# EAGLE design SIM900_schematic (EAGLE 7.6.0)

## Sheet 1 of 2
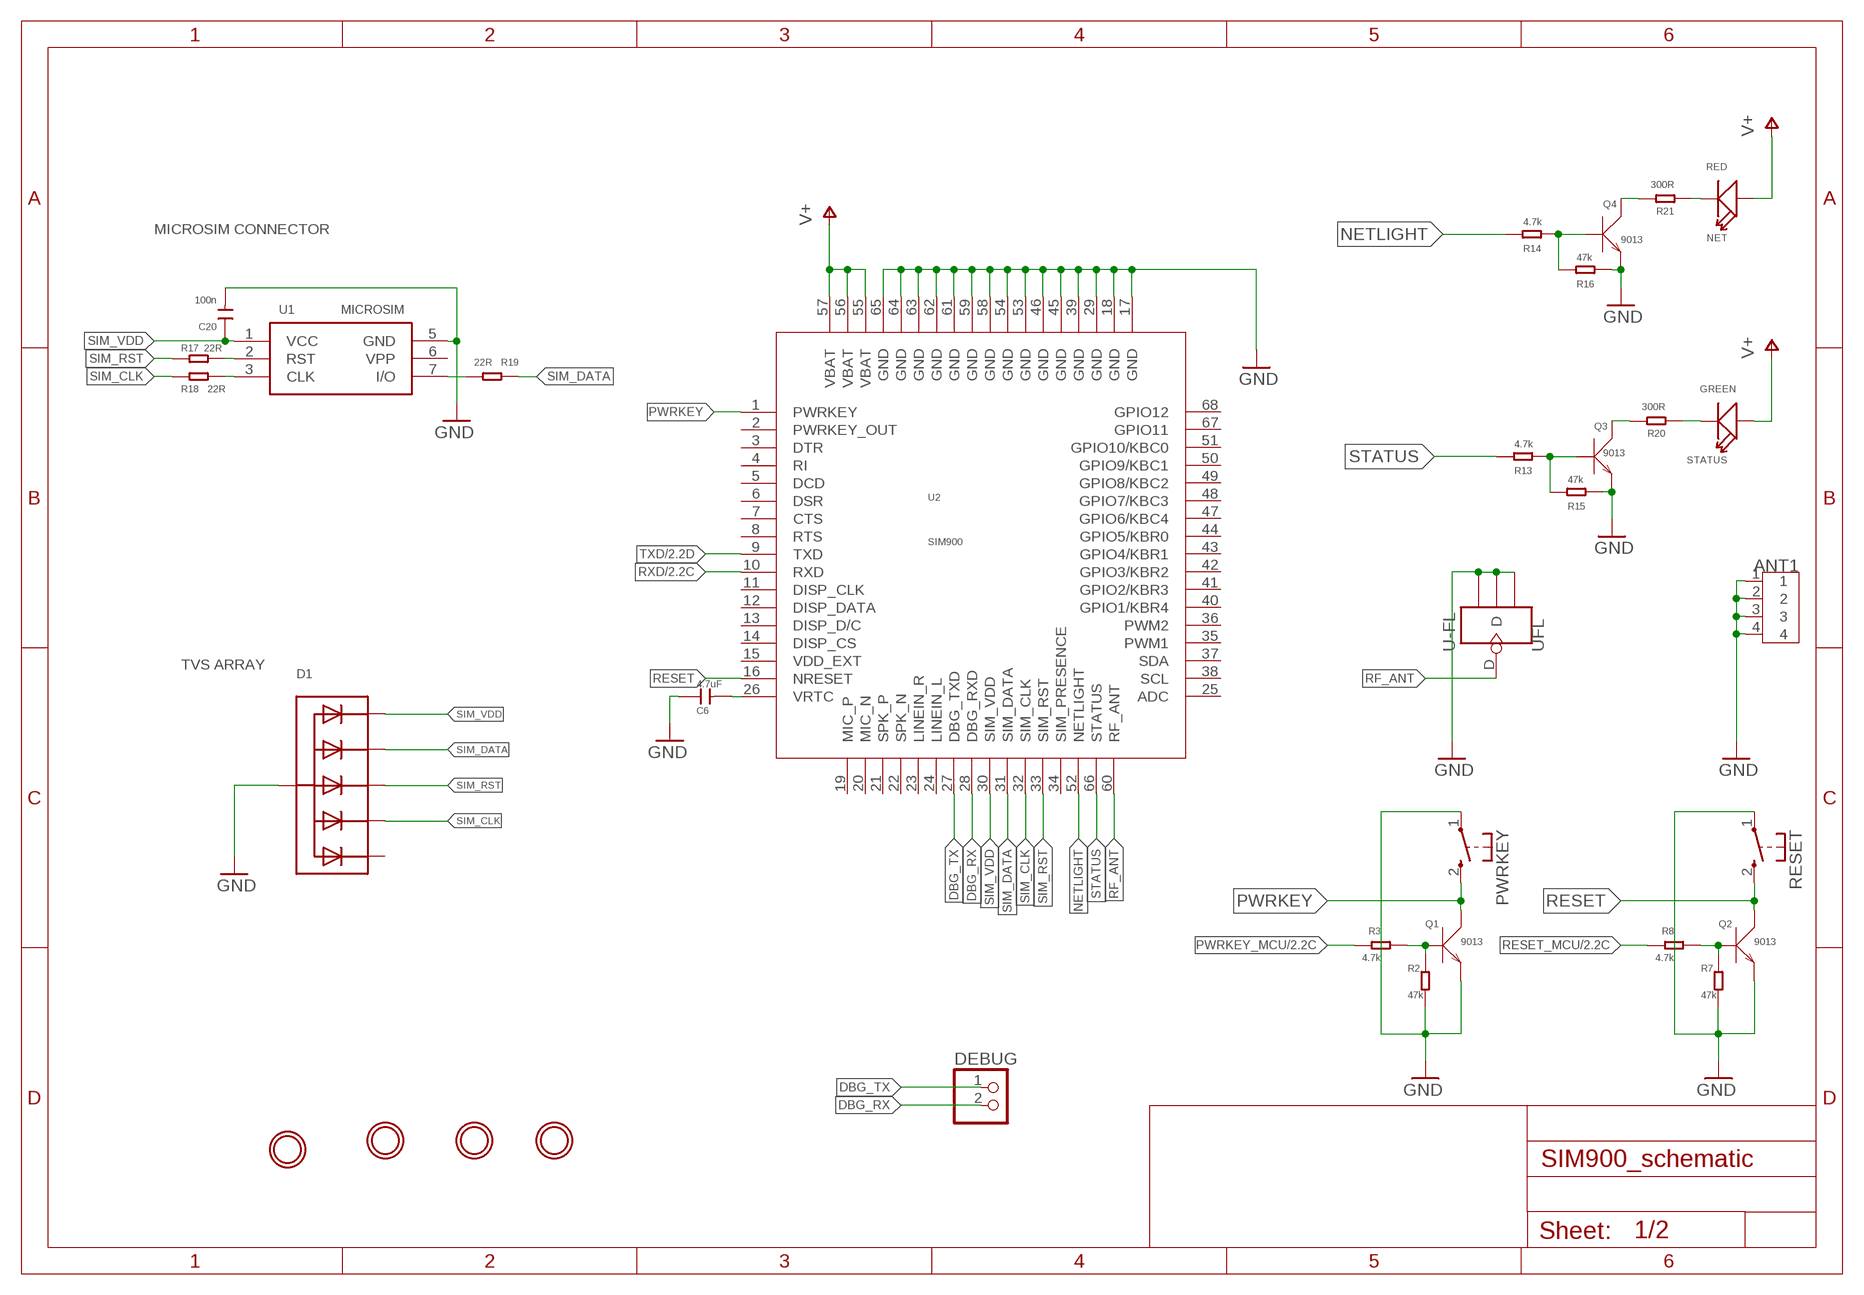
[diagram p0: schematic, sheet 1]

### Parts
ANT1  ANTENNA-SMA-IPX  [SMA-TO-IPX]
C6  4.7uF  C-0805  [0805]
C20  100n  C-0805  [0805]
D1  TVSARRAY_5LANE  [SOT363]
DEBUG  PINHD-1X2  [1X02]
NET  RED  LED'0805'  [LED-0805]
PWRKEY  KSS-2EG4430  [KSS-2EG4430]
Q1  9013  TRANSISTOR-NPN-SOT23  [SOT23]
Q2  9013  TRANSISTOR-NPN-SOT23  [SOT23]
Q3  9013  TRANSISTOR-NPN-SOT23  [SOT23]
Q4  9013  TRANSISTOR-NPN-SOT23  [SOT23]
R2  47k  R-0805  [0805]
R3  4.7k  R-0805  [0805]
R7  47k  R-0805  [0805]
R8  4.7k  R-0805  [0805]
R13  4.7k  R-0805  [0805]
R14  4.7k  R-0805  [0805]
R15  47k  R-0805  [0805]
R16  47k  R-0805  [0805]
R17  22R  R-0805  [0805]
R18  22R  R-0805  [0805]
R19  22R  R-0805  [0805]
R20  300R  R-0805  [0805]
R21  300R  R-0805  [0805]
RESET  KSS-2EG4430  [KSS-2EG4430]
STATUS  GREEN  LED'0805'  [LED-0805]
U1  MICROSIM  [MICROSIM]
U2  SIM900  [SIM900]
U$1  MOUNTINGHOLE3.0THIN  [MOUNTINGHOLE_3.0_PLATEDTHIN]
U$2  MOUNTINGHOLE3.0THIN  [MOUNTINGHOLE_3.0_PLATEDTHIN]
U$3  MOUNTINGHOLE3.0THIN  [MOUNTINGHOLE_3.0_PLATEDTHIN]
U$4  MOUNTINGHOLE3.0THIN  [MOUNTINGHOLE_3.0_PLATEDTHIN]
UFL  U-FL  ANTENNA-U-FL  [4P-U-FL]

### Nets
DBG_RX: DEBUG.2 U2.28(DBG_RXD)
DBG_TX: DEBUG.1 U2.27(DBG_TXD)
GND: ANT1.1 ANT1.2 ANT1.3 ANT1.4 C6.1 C20.2 D1.2(A) PWRKEY.1(P) Q1.2(E) Q2.2(E) Q3.2(E) Q4.2(E) R2.2 R7.2 R15.2 R16.2 RESET.1(P) U1.5(GND) U2.17(GND) U2.18(GND) U2.29(GND) U2.39(GND) U2.45(GND) U2.46(GND) U2.53(GND) U2.54(GND) U2.58(GND) U2.59(GND) U2.61(GND) U2.62(GND) U2.63(GND) U2.64(GND) U2.65(GND) UFL.GND1 UFL.GND2 UFL.GND3 ; also sheet 2
N$1: Q2.1(B) R7.1 R8.2
N$3: Q3.3(C) R20.2
N$4: R19.2 U1.7(I/O)
N$5: R18.1 U1.3(CLK)
N$6: R17.1 U1.2(RST)
N$7: R20.1 STATUS.-
N$8: Q3.1(B) R13.2 R15.1
N$16: Q4.3(C) R21.2
N$17: NET.- R21.1
N$18: Q4.1(B) R14.2 R16.1
N$36: Q1.1(B) R2.1 R3.2
NETLIGHT: R14.1 U2.52(NETLIGHT)
PWRKEY: PWRKEY.2(S) Q1.3(C) U2.1(PWRKEY)
PWRKEY_MCU: R3.1 ; also sheet 2
RESET: Q2.3(C) RESET.2(S) U2.16(NRESET)
RESET_MCU: R8.1 ; also sheet 2
RF_ANT [ref]: U2.60(RF_ANT) UFL.D
RXD: U2.10(RXD) ; also sheet 2
SIM_CLK: D1.5(C4) R18.2 U2.32(SIM_CLK)
SIM_DATA: D1.3(C2) R19.1 U2.31(SIM_DATA)
SIM_RST: D1.4(C3) R17.2 U2.33(SIM_RST)
SIM_VDD: C20.1 D1.1(C1) U1.1(VCC) U2.30(SIM_VDD)
STATUS: R13.1 U2.66(STATUS)
TXD: U2.9(TXD) ; also sheet 2
V+: NET.+ STATUS.+ U2.55(VBAT) U2.56(VBAT) U2.57(VBAT) ; also sheet 2
VRTC: C6.2 U2.26(VRTC)
Unconnected: D1.6(C5) U1.6(VPP) U2.2(PWRKEY_OUT) U2.3(DTR) U2.4(RI) U2.5(DCD) U2.6(DSR) U2.7(CTS) U2.8(RTS) U2.11(DISP_CLK) U2.12(DISP_DATA) U2.13(DISP_D/C) U2.14(DISP_CS) U2.15(VDD_EXT) U2.19(MIC_P) U2.20(MIC_N) U2.21(SPK_P) U2.22(SPK_N) U2.23(LINEIN_R) U2.24(LINEIN_L) U2.25(ADC) U2.34(SIM_PRESENCE) U2.35(PWM1) U2.36(PWM2) U2.37(SDA) U2.38(SCL) U2.40(GPIO1/KBR4) U2.41(GPIO2/KBR3) U2.42(GPIO3/KBR2) U2.43(GPIO4/KBR1) U2.44(GPIO5/KBR0) U2.47(GPIO6/KBC4) U2.48(GPIO7/KBC3) U2.49(GPIO8/KBC2) U2.50(GPIO9/KBC1) U2.51(GPIO10/KBC0) U2.67(GPIO11) U2.68(GPIO12)

### Notes on the sheet
- MICROSIM CONNECTOR
- TVS ARRAY

## Sheet 2 of 2
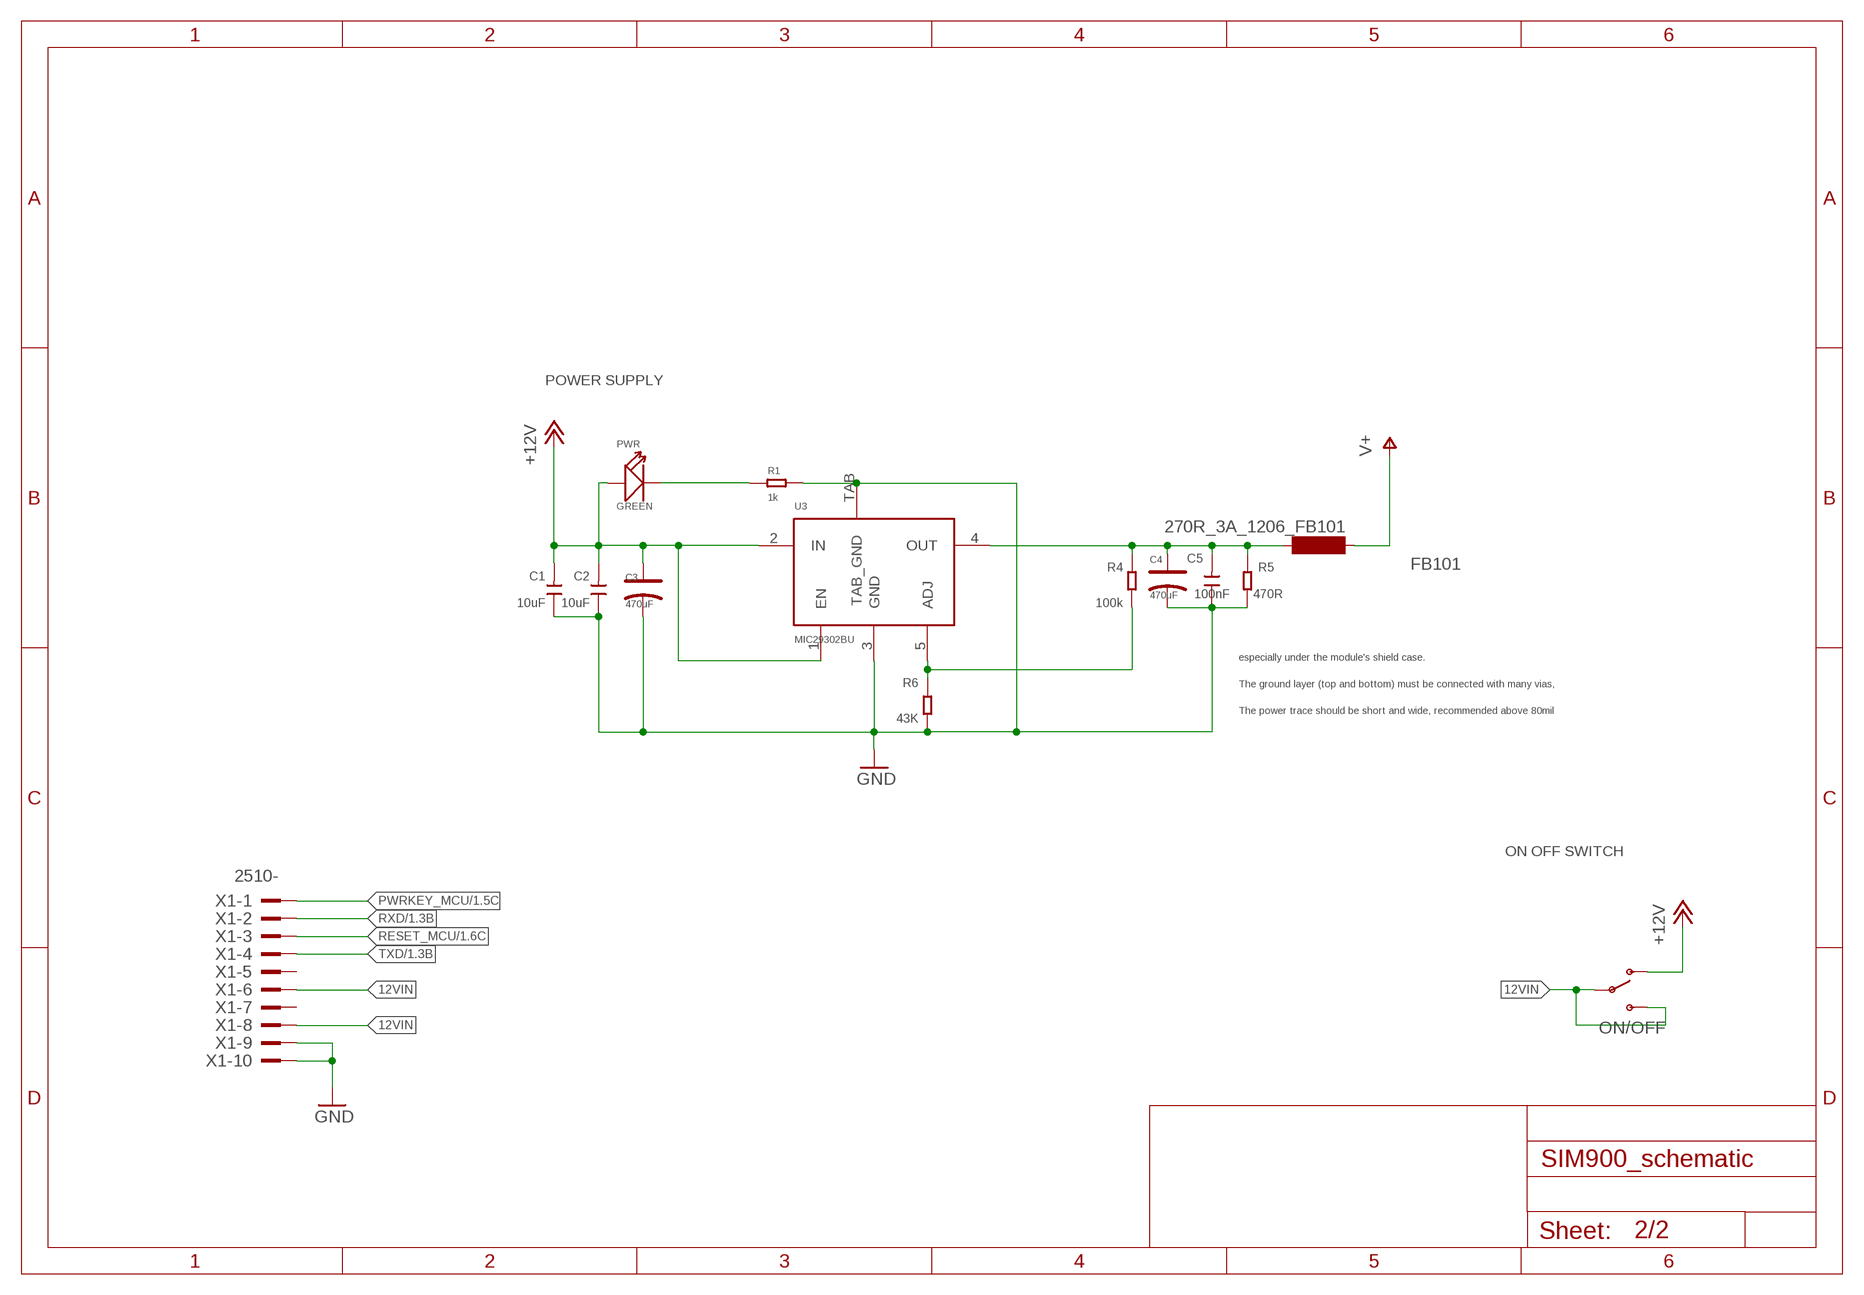
[diagram p1: schematic, sheet 2]

### Parts
C1  10uF  C-0805  [0805]
C2  10uF  C-0805  [0805]
C3  470uF  006-CAP_AVX_D  [AVX_D]
C4  470uF  006-CAP_AVX_D  [AVX_D]
C5  100nF  C-0805  [0805]
FB101  270R_3A_1206_FB101  SM-1206  [SM-1206]
ON/OFF  SWITCH-SPDTPTH  [SWITCH-SPDT]
PWR  GREEN  007-LED0805  [D0805]
R1  1k  R-0805  [0805]
R4  100k  R-0805  [0805]
R5  470R  R-0805  [0805]
R6  43K  R-0805  [0805]
U3  MIC29302BU  [TO-263]
X1  2510-  [PAK100/2500-10]

### Nets
12VIN: ON/OFF.2(P) ON/OFF.3(S) X1.6 X1.8
+12V: C1.2 C2.2 C3.+ ON/OFF.1(O) PWR.+ U3.1(EN) U3.2(IN)
GND: C1.1 C2.1 C3.- C4.- C5.1 R1.2 R5.1 R6.1 U3.3(GND) U3.TAB(TAB_GND) X1.9 X1.10 ; also sheet 1
N$2: R4.1 R6.2 U3.5(ADJ)
N$53: PWR.- R1.1
PWRKEY_MCU: X1.1 ; also sheet 1
RESET_MCU: X1.3 ; also sheet 1
RXD: X1.2 ; also sheet 1
TXD: X1.4 ; also sheet 1
V+: FB101.1 ; also sheet 1
VOUT: C4.+ C5.2 FB101.2 R4.2 R5.2 U3.4(OUT)
Unconnected: X1.5 X1.7

### Notes on the sheet
- POWER SUPPLY
- especially under the module's shield case.
- The ground layer (top and bottom) must be connected with many vias,
- The power trace should be short and wide, recommended above 80mil
- ON OFF SWITCH

## Library data of the parts
ANT1 = Connector:ANTENNA-SMA-IPX
C1 C2 C5 C6 C20 = Discrete:C*: Ceramic Capacitors
C3 C4 = Discrete:006-CAP*: Electrolytic Capacitors,Tantalum Capacitors and Super Capacitors
D1 = Adafruit SIM808 Breakout:TVSARRAY_5LANE: Voltage Transient Suppressor Array SOT363 SMF05C - 100W 5V: Digikey - SMF05CT1GOSCT-ND
DEBUG = pinhead:PINHD-1X2: PIN HEADER
FB101 = inductor-neosid:SM-1206: INDUCTOR SMD chip inductor; OC_FARNELL: unknown; OC_NEWARK: unknown
NET STATUS = Discrete:LED*
ON/OFF = SparkFun-Electromechanical:SWITCH-SPDT: SPDT Switch Simple slide switch, Spark Fun Electronics SKU : COM-00102 DPDT SMT slide switch, AYZ0202, SWCH-08179; PROD_ID: SWCH-08261
PWR = Discrete:007-LED*
PWRKEY RESET = buttons:KSS-2EG4430: Size: 3x6mm Height: 5mm from PCB Rating: DC12v 50mA Travel: 0.25±0.10mm Operating Force: 180±50gf Return Force: 60gf min Contact resistance: 100m? max Insulation resistance: 100M? min Operating life?50,000 cycles
Q1-Q4 = Discrete:TRANSISTOR-NPN*: NPN audion
R1-R8 R13-R21 = Discrete:R*
U1 = GPRS+GSM+GPS Shield v1.0:MICROSIM
U2 = ICs_v54:SIM900
U3 = ICs_v54:MIC29302
U$1-U$4 = Adafruit SIM808 Breakout:MOUNTINGHOLE: Mounting Hole For #2 screws (0.086"/2.18mm width, 0.094"/2.4mm hole) use 2.5mm; BOM: EXCLUDE
UFL = Connector:ANTENNA-U-FL
X1 = con-3m:2510-: 3M (TM) Pak 100 4-Wall Header Source: 3M; MF: 3M; MPN: 2510-6002UB; OC_FARNELL: 9838244; OC_NEWARK: 46F4725

## Net classes
0 default: width 0.203 mm, drill 0.356 mm, clearance 0.203 mm
1 ref: width 0.635 mm, drill 1.27 mm, clearance 0.61 mm

## Board
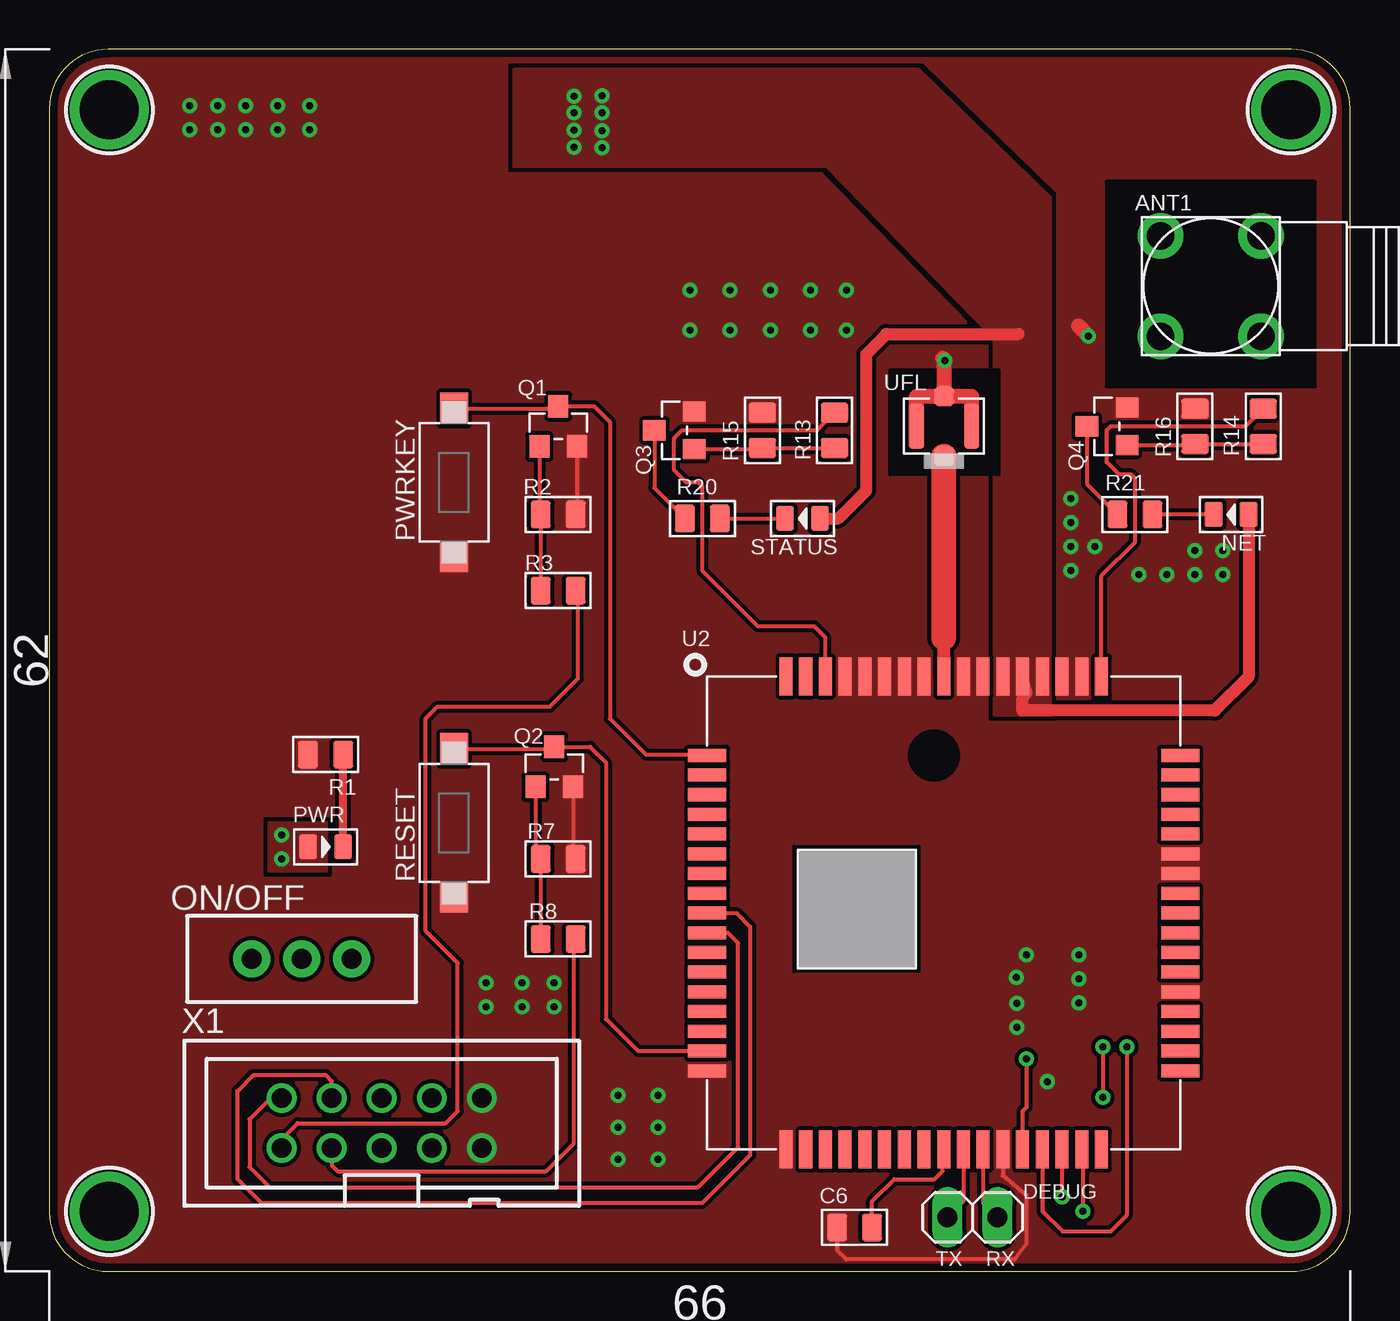
[diagram p2: board, top side]
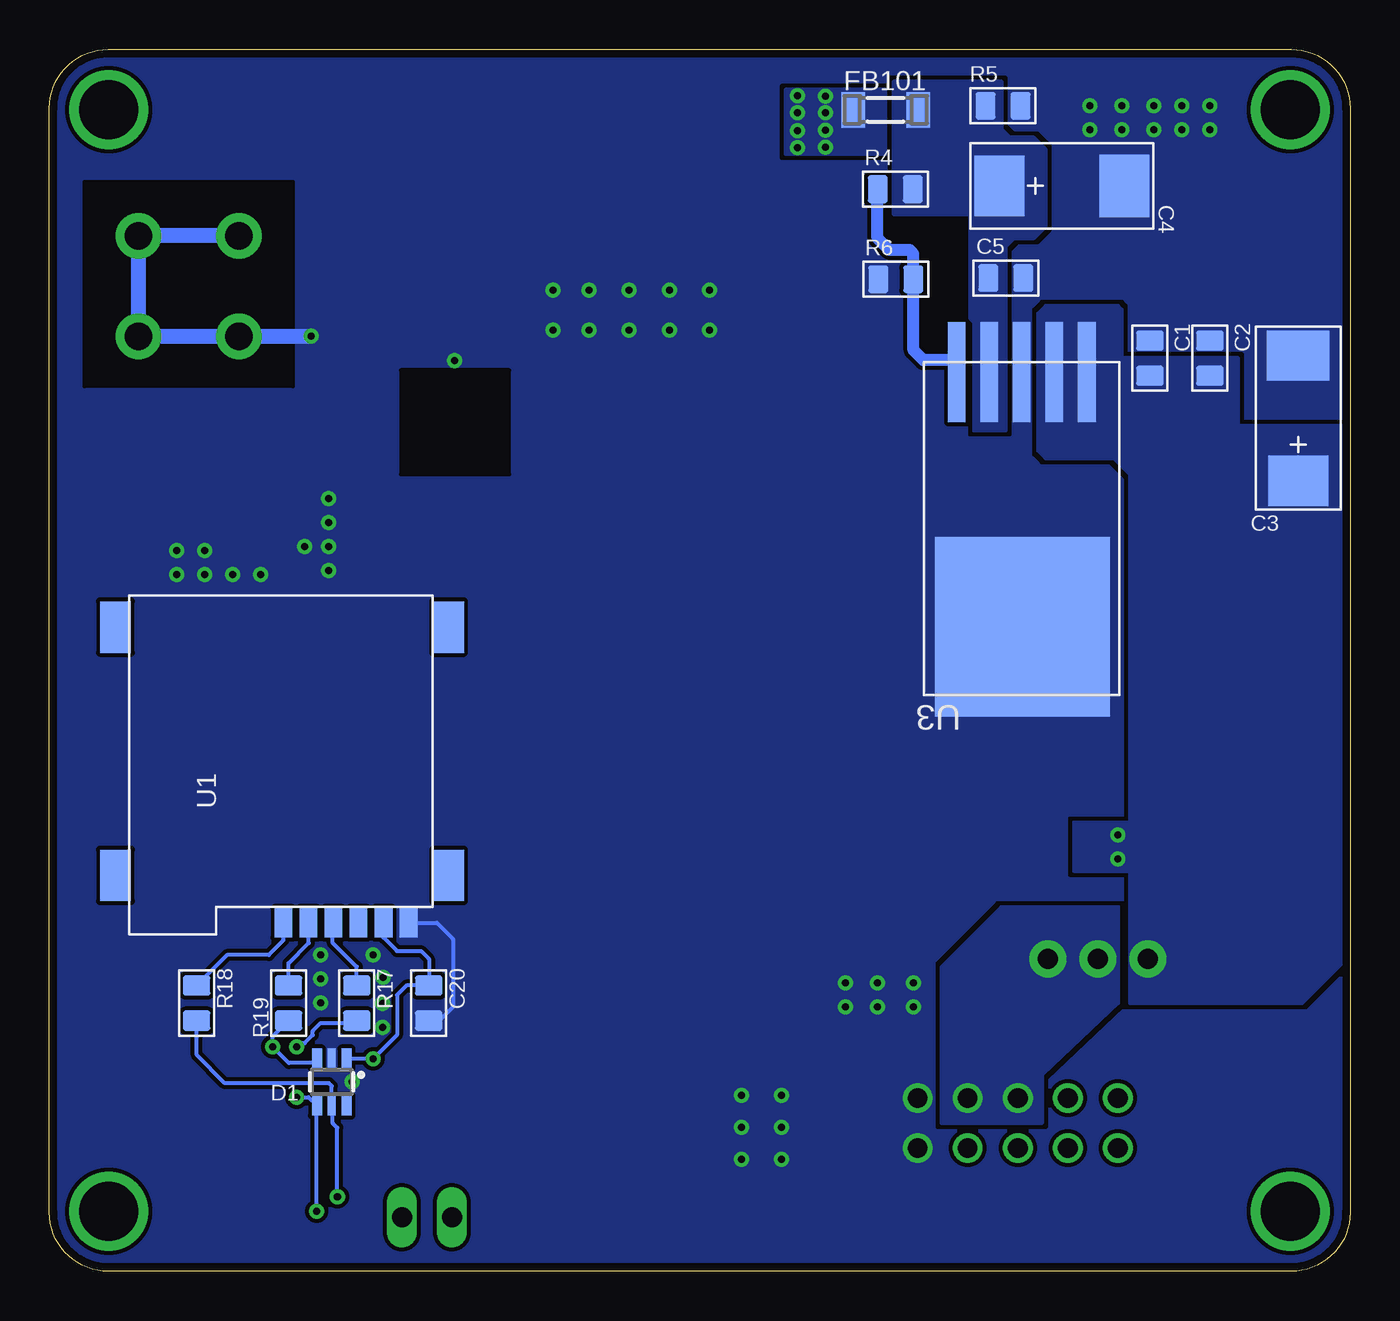
[diagram p3: board, bottom side, seen from below]

Size 66 x 62 mm. Coordinates in mm from the lower left corner, seen from the top.
Outline: 3,0 63,0 arc90 66,3 66,59 arc90 63,62 3,62 arc90 0,59 0,3 arc90 3,0
Copper layers (1*16): Top 0.035mm / dielectric 1.5mm / Bottom 0.035mm
Design rules "default *": minimum track width 8mil, minimum drill 14mil, track to track 6mil, track to pad 6mil, pad to pad 6mil, via to via 6mil, smd to smd 6mil, copper to edge 16mil, drill to drill 8mil, minimum pad ring 10mil, minimum via ring 8mil, stop-mask expansion 4mil, vias tented up to drill 14mil, thermal gap 10mil

### Footprints (pad centres in the part's own frame; a part is rotated, then mirrored left to right if it is on the bottom)
SMA-TO-IPX = drill 1.4 pad 2.3: 1 -2.55,2.55; 2 2.55,2.55; 3 2.55,-2.55; 4 -2.55,-2.55
0805 = smd 1.016 x 1.397: 1 -0.889,0; 2 0.889,0
AVX_D = smd 2.54 x 3.048: + -3.175,0 | smd 2.54 x 3.175: - 3.175,0
SOT363 = smd 0.5 x 1: 1 -0.75,-1.2; 3 0.75,-1.2; 4 0.75,1.2; 6 -0.75,1.2 | smd 0.4 x 1: 2 0,-1.2; 5 0,1.2
1X02 = drill 1.016 long: 1 -1.27,0; 2 1.27,0
SM-1206 = smd 1.2 x 1.8: 1 -1.65,0; 2 1.65,0
LED-0805 = smd 0.889 x 1.27: + -0.889,0; - 0.889,0
SWITCH-SPDT = drill 1.016 pad 1.88: 1 0,2.54; 2 0,0; 3 0,-2.54
D0805 = smd 0.889 x 1.27: + -0.889,0; - 0.889,0
KSS-2EG4430 = smd 1.6 x 1.4: 1 -3.75,0; 2 3.75,0
SOT23 = smd 1.016 x 1.143: 1 -0.95,-1.016; 2 0.95,-1.016; 3 0,1.016
MICROSIM = smd 1.5 x 0.9: 1 -0.8,2.5; 2 -0.8,5.04; 3 -0.8,7.58; 5 -0.8,1.23; 6 -0.8,3.77; 7 -0.8,6.31 | smd 2.61 x 1.56: P$1 1.6,-0.8; P$2 14.2,-0.8; P$3 14.2,16.1; P$4 1.6,16.1
SIM900 = smd 1.93 x 0.66: 1 -12,8; 2 -12,7; 3 -12,6; 4 -12,5; 5 -12,4; 6 -12,3; 7 -12,2; 8 -12,1; 9 -12,0; 10 -12,-1; 11 -12,-2; 12 -12,-3; 13 -12,-4; 14 -12,-5; 15 -12,-6; 16 -12,-7; 17 -12,-8; 35 12,-8; 36 12,-7; 37 12,-6; 38 12,-5; 39 12,-4; 40 12,-3; 41 12,-2; 42 12,-1; 43 12,0; 44 12,1; 45 12,2; 46 12,3; 47 12,4; 48 12,5; 49 12,6; 50 12,7; 51 12,8 | smd 0.66 x 1.93: 18 -8,-12; 19 -7,-12; 20 -6,-12; 21 -5,-12; 22 -4,-12; 23 -3,-12; 24 -2,-12; 25 -1,-12; 26 0,-12; 27 1,-12; 28 2,-12; 29 3,-12; 30 4,-12; 31 5,-12; 32 6,-12; 33 7,-12; 34 8,-12; 52 8,12; 53 7,12; 54 6,12; 55 5,12; 56 4,12; 57 3,12; 58 2,12; 59 1,12; 60 0,12; 61 -1,12; 62 -2,12; 63 -3,12; 64 -4,12; 65 -5,12; 66 -6,12; 67 -7,12; 68 -8,12
TO-263 = smd 5.08 x 0.889: 1 4.572,-3.302; 2 4.572,-1.651; 3 4.572,0; 4 4.572,1.651; 5 4.572,3.302 | smd 9.12 x 8.89: TAB -8.341,-0.03
MOUNTINGHOLE_3.0_PLATEDTHIN = drill 3 pad 3.6: P$1 0,0
4P-U-FL = smd 1.016 x 1.016: D -1.524,0; GND3 1.524,0 | smd 2.286 x 0.762: GND1 0,1.397; GND2 0,-1.397
PAK100/2500-10 = drill 1 pad 1.422: 1 -5.08,-1.27; 2 -5.08,1.27; 3 -2.54,-1.27; 4 -2.54,1.27; 5 0,-1.27; 6 0,1.27; 7 2.54,-1.27; 8 2.54,1.27; 9 5.08,-1.27; 10 5.08,1.27

### Placement (x,y rotation side)
ANT1  58.93,49.99 90 top
C1  10.16,46.33 270 bottom
C2  7.11,46.33 270 bottom
C3  2.64,43.28 90 bottom
C4  14.63,55.07 0 bottom
C5  17.48,50.39 180 bottom
C6  40.85,2.23 0 top
C20  46.75,13.61 270 bottom
D1  51.67,9.61 180 bottom
DEBUG  46.84,2.74 0 top
FB101  23.57,58.93 0 bottom
NET  59.96,38.4 180 top
ON/OFF  12.8,15.85 90 top
PWR  14.02,21.54 0 top
PWRKEY  20.53,40.03 90 top
Q1  25.82,42.87 0 top
Q2  25.61,25.6 0 top
Q3  31.71,42.67 90 top
Q4  53.66,42.87 90 top
R1  14.02,26.21 180 top
R2  25.82,38.4 0 top
R3  25.82,34.54 180 top
R4  23.08,54.9 0 bottom
R5  17.61,59.13 180 bottom
R6  23.05,50.33 0 bottom
R7  25.82,20.92 0 top
R8  25.82,16.86 180 top
R13  39.84,42.67 270 top
R14  61.58,42.87 270 top
R15  36.18,42.67 90 top
R16  58.13,42.87 90 top
R17  50.4,13.61 270 bottom
R18  58.53,13.61 270 bottom
R19  53.86,13.61 90 bottom
R20  33.13,38.2 180 top
R21  55.08,38.4 180 top
RESET  20.53,22.75 90 top
STATUS  38.21,38.2 180 top
U1  46.54,18.49 90 bottom
U2  45.38,18.18 0 top
U3  16.66,41.05 90 bottom
U$1  3.05,3.05 90 top
U$2  3.05,58.93 90 top
U$3  62.99,58.93 90 top
U$4  62.99,3.05 90 top
UFL  45.39,42.88 90 top
X1  16.87,7.52 0 top

### Tracks (layer width: path | path; a pad name or v marks a point on that pad's centre or on a via)
12VIN
  pour Bottom (no thermals): 15.65,7.52 20.73,7.52 20.73,15.44 17.68,18.49 11.79,18.49 11.79,13.61 15.65,9.96
+12V  (via drill 0.36 pad 0.76)
  other vias: 11.79,22.15 11.79,20.93
  pour Bottom (no thermals): 11.18,13.61 2.44,13.61 0.41,15.65 0.41,42.88 5.69,42.88 5.69,46.33 11.58,46.33 11.58,48.77 11.79,48.97 15.44,48.97 15.85,48.56 15.85,41.66 15.44,41.25 11.99,41.25 11.18,40.44
  pour Bottom (no thermals): 11.18,22.76 14.02,22.76 14.02,20.32 11.18,20.32
  pour Top (no thermals): 11.18,22.76 14.02,22.76 14.02,20.32 11.18,20.32
DBG_RX
  Top 0.203: U2.28 47.38,3.48 DEBUG.2
DBG_TX
  Top 0.203: U2.27 46.38,3.55 DEBUG.1
GND  (via drill 0.36 pad 0.76)
  Top 0.203: U2.29 48.38,4.86 49.58,3.86 49.58,1.42 48.97,0.61 40.44,0.61 39.97,1.08 C6.1 | Q2.2 26.56,21.07 R7.2 | Q1.2 26.77,38.46 R2.2
  Top 0.762: UFL.GND1 43.99,44.4 UFL.GND3 45.41,44.4 | 45.41,44.4 46.79,44.4 UFL.GND2 | 45.41,44.4 45.41,46.23 45.31,46.33 | v52.72,47.45 52.43,47.75 52.22,47.95
  Bottom 0.203: U1.5 46.34,17.69 45.52,16.87 45.52,13.41 46.33,12.6 46.62,12.6 C20.2
  Bottom 0.762: ANT1.2 ANT1.3 ANT1.4 ANT1.1 52.72,47.44 v52.72,47.45
  other vias: 11.58,57.91 13.21,57.91 7.11,57.91 13.21,59.13 7.11,59.13 9.96,59.13 8.53,59.13 11.58,59.13 9.96,57.91 8.53,57.91 32.51,49.78 34.54,49.78 38.61,49.78 40.44,49.78 36.58,49.78 36.58,47.75 34.54,47.75 32.51,47.75 55.27,35.36 56.69,35.36 58.12,35.36 59.54,35.36 58.12,36.58 59.54,36.58 51.82,38 51.82,36.78 51.82,35.56 53.04,36.78 51.82,39.22 49.07,14.91 49.58,16.05 52.22,16.05 52.22,14.83 52.22,13.61 50.65,9.63 49.09,12.37 49.09,13.59 28.85,8.94 30.89,8.94 30.89,7.32 28.85,7.32 28.85,5.69 30.89,5.69 22.15,14.63 23.98,14.63 25.6,14.63 25.6,13.41 23.98,13.41 22.15,13.41 40.44,47.75 38.61,47.75 45.43,46.22
  pour Top (rank 6, no thermals): -0.2,62.18 66.24,62.18 66.24,-0.2 -0.2,-0.2
  pour Bottom (rank 6, no thermals): -0.2,62.18 66.24,62.18 66.24,-0.2 -0.2,-0.2
N$1
  Top 0.203: Q2.1 24.66,21.19 R7.1 R8.2
N$2
  Bottom 0.61: U3.5 19.91,46.23 21.64,46.23 22.15,46.74 22.15,50.32 R6.2 22.16,51.63 22.35,51.82 23.37,51.82 23.98,52.43 23.98,54.28 R4.1
N$3
  Top 0.203: Q3.3 30.69,39.75 R20.2
N$4
  Bottom 0.203: R19.2 53.86,15.63 52.83,16.66 52.83,17.66 U1.7
N$5
  Bottom 0.203: U1.3 54.12,16.79 54.86,16.05 56.98,16.05 R18.1
N$6
  Bottom 0.203: R17.1 50.41,15.45 51.61,16.66 51.61,17.66 U1.2
N$7
  Top 0.203: R20.1 STATUS.-
N$8
  Top 0.203: Q3.1 36.12,41.72 R15.1 R13.2
N$9
  cutout Top: 37.8,21.54 44.09,21.54 44.09,15.24 37.8,15.24
N$10
  cutout Top: 42.67,45.72 48.16,45.72 48.16,40.44 42.67,40.44
N$11
  cutout Bottom: 42.67,45.72 48.16,45.72 48.16,40.44 42.67,40.44
N$12
  cutout Top: 53.64,44.91 64.21,44.91 64.21,55.27 53.64,55.27
N$13
  cutout Bottom: 53.64,44.91 64.21,44.91 64.21,55.27 53.64,55.27
N$16
  Top 0.203: Q4.3 52.64,39.95 R21.2
N$17
  Top 0.203: NET.- R21.1
N$18
  Top 0.203: Q4.1 58.06,41.92 R16.1 R14.2
N$36
  Top 0.203: Q1.1 24.87,38.46 R2.1 R3.2
N$53
  Top 0.406: PWR.- R1.1
NETLIGHT
  Top 0.203: U2.52 53.38,35.29 55.07,36.98 55.07,40.23 54.86,40.44 54.25,40.44 53.65,41.05 53.65,42.67 53.85,42.88 60.7,42.88 R14.1
PWRKEY
  Top 0.203: PWRKEY.2 25.71,43.78 Q1.3 27.64,43.89 28.45,43.08 28.45,28.04 30.28,26.21 33.34,26.21 U2.1
PWRKEY_MCU
  Top 0.203: X1.1 11.79,6.71 12.6,7.52 20.12,7.52 20.73,8.13 20.73,15.65 19.1,17.27 19.1,28.04 19.71,28.65 25.4,28.65 26.82,30.07 26.82,34.42 R3.1
RESET
  Top 0.203: RESET.2 25.5,26.5 Q2.3 27.44,26.61 28.25,25.81 28.25,12.8 29.87,11.18 U2.16
RESET_MCU
  Top 0.203: X1.3 14.33,5.38 14.63,5.08 25.2,5.08 26.62,6.5 26.62,16.77 R8.1
RF_ANT
  Top 0.66: U2.60 45.38,31.2 45.38,31.41 45.38,32.14
  Top 1.27: 45.38,32.14 45.38,41.34 UFL.D
RXD
  Top 0.203: X1.2 11.23,8.79 10.16,7.72 10.16,5.28 11.18,4.27 32.92,4.27 34.95,6.3 34.95,16.66 34.43,17.18 U2.10
SIM_CLK  (via drill 0.36 pad 0.76)
  Top 0.203: U2.32 v51.38,3.78 v51.38,3.77
  Bottom 0.203: R18.2 58.52,12.71 58.52,10.97 57.1,9.55 51.82,9.55 51.67,9.4 D1.5 51.61,8.36 51.61,7.52 51.38,7.29 v51.38,3.77
SIM_DATA  (via drill 0.36 pad 0.76)
  Top 0.203: v54.66,11.38 54.66,2.85 53.85,2.03 51.41,2.03 50.39,3.05 50.39,6.16 U2.31
  Bottom 0.203: 54.13,12.72 R19.1 54.66,11.92 v54.66,11.38 53.85,10.57 52.63,10.57 52.48,10.72 D1.3
SIM_RST  (via drill 0.36 pad 0.76)
  Top 0.203: U2.33 52.43,6.23 v52.43,3.05 | v53.44,11.38 v53.44,8.84
  Bottom 0.203: v53.44,11.38 53.24,11.58 53.03,11.58 52.63,11.99 52.63,12.19 52.22,12.6 50.53,12.6 R17.2 | v53.44,8.84 52.84,8.84 D1.4 v52.43,3.05
SIM_VDD  (via drill 0.36 pad 0.76)
  Top 0.203: v49.58,10.77 49.58,8.33 49.38,8.13 U2.30
  Bottom 0.203: U1.1 49.04,16.94 48.36,16.26 47.14,16.26 46.74,15.85 46.74,14.51 C20.1 47.88,14.5 48.36,14.02 48.36,11.99 v49.58,10.77 50.86,10.77 D1.1
STATUS
  Top 0.203: U2.66 39.38,32.15 38.81,32.72 35.97,32.72 33.12,35.56 33.12,39.83 32.92,40.03 32.31,40.03 31.7,40.64 31.7,42.27 32.11,42.67 38.95,42.67 R13.1
TXD
  Top 0.203: U2.9 34.85,18.18 35.56,17.48 35.56,5.89 33.12,3.45 10.77,3.45 9.55,4.67 9.55,9.14 10.36,9.96 14.02,9.96 14.33,9.65 X1.4
V+  (via drill 0.36 pad 0.76)
  Top 0.61: NET.+ 60.84,30.16 59.13,28.45 49.38,28.45 49.38,29.06 49.58,29.37 U2.56 | STATUS.+ 40.03,38.2 41.45,39.62 41.45,46.53 42.47,47.55 49.17,47.55
  other vias: 26.62,59.63 28.05,59.65 28.04,58.79 26.62,58.78 26.62,57.89 28.04,57.86 28.04,57.01 26.62,57.02
  pour Top (no thermals): 47.96,28.24 50.8,28.24 50.8,54.46 44.09,60.96 23.57,60.96 23.57,56.08 39.42,56.08 47.96,47.35
  pour Bottom (no thermals): 23.57,59.94 28.65,59.94 28.65,56.69 23.57,56.69
VOUT
  pour Bottom (no thermals): 17.48,42.67 17.48,52.02 17.07,52.43 16.05,52.43 15.44,53.04 15.44,56.9 16.05,57.51 17.27,57.51 17.68,57.91 17.68,60.35 23.16,60.35 23.16,53.64 19.3,53.64 19.3,48.36 19.1,48.16 19.1,42.67
VRTC
  Top 0.203: C6.2 41.74,3.54 42.88,4.67 44.91,4.67 45.31,5.08 45.31,6.12 U2.26

### Text on the board
tNames: TX | RX